# Altium project keckologger.PrjPcb
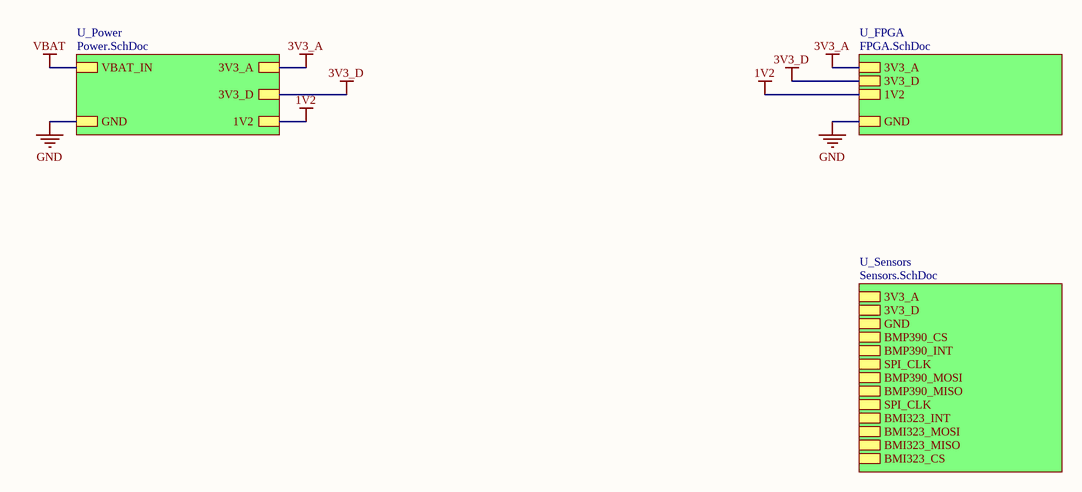
[diagram p0: Main.SchDoc]
7 sheets, 42 parts. Net scope: strictly hierarchical (ports join the sheet entries above them; power ports are local).
Sheets:
  Main.SchDoc
    U_FPGA = FPGA.SchDoc
    U_Power = Power.SchDoc
    U_Sensors = Sensors.SchDoc
  GPS.SchDoc
  Transmitter.SchDoc
  SD Card Reader.SchDoc

## Sheet Main.SchDoc
size A; SheetNumber: 1; SheetTotal: 6

### Sub-sheets
U_FPGA = FPGA.SchDoc: 3V3_A, 3V3_D, 1V2, GND
U_Power = Power.SchDoc: VBAT_IN, GND, 3V3_A, 3V3_D, 1V2
U_Sensors = Sensors.SchDoc: 3V3_A, 3V3_D, GND, BMP390_CS, BMP390_INT, SPI_CLK, BMP390_MOSI, BMP390_MISO, SPI_CLK, BMI323_INT, BMI323_MOSI, BMI323_MISO, BMI323_CS

### Nets
1V2: sheet U_FPGA/1V2, sheet U_Power/1V2
3V3_A: sheet U_FPGA/3V3_A, sheet U_Power/3V3_A
3V3_D: sheet U_FPGA/3V3_D, sheet U_Power/3V3_D
GND: sheet U_FPGA/GND, sheet U_Power/GND
SPI_CLK: sheet U_Sensors/SPI_CLK, sheet U_Sensors/SPI_CLK

## Sheet FPGA.SchDoc
size A; SheetNumber: 3; SheetTotal: 4
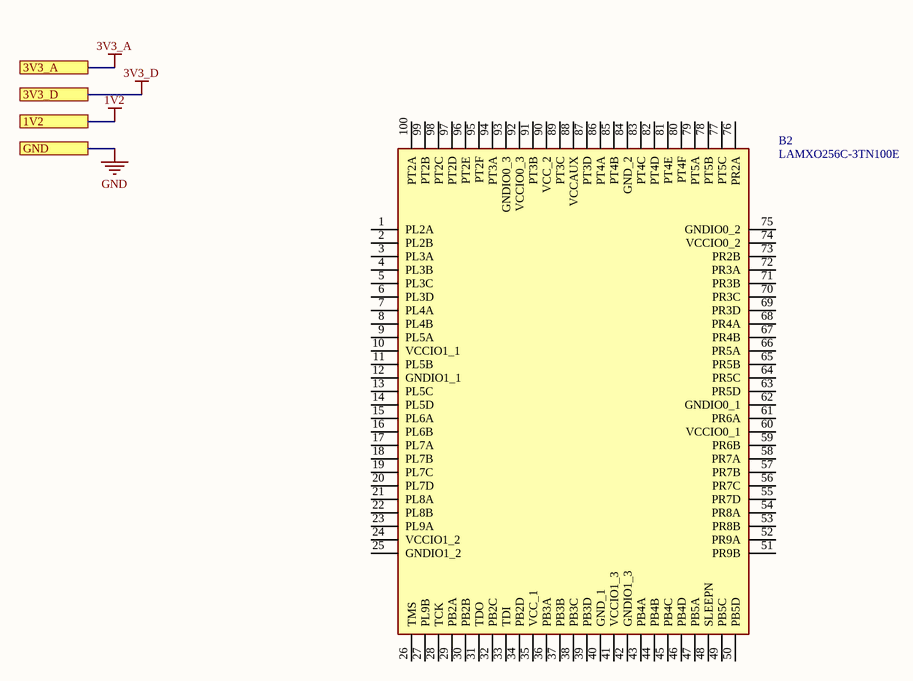
[diagram p1: FPGA.SchDoc]

### Parts
B2  LAMXO256C-3TN100E  [QFP50P1600X1600X160-100N]

### Ports
1V2, 3V3_A, 3V3_D, GND

### Nets

Not connected (* = marked no-connect by the designer): B2 1(PL2A) 2(PL2B) 3(PL3A) 4(PL3B) 5(PL3C) 6(PL3D) 7(PL4A) 8(PL4B) 9(PL5A) 10(VCCIO1_1) 11(PL5B) 12(GNDIO1_1) 13(PL5C) 14(PL5D) 15(PL6A) 16(PL6B) 17(PL7A) 18(PL7B) 19(PL7C) 20(PL7D) 21(PL8A) 22(PL8B) 23(PL9A) 24(VCCIO1_2) 25(GNDIO1_2) 26(TMS) 27(PL9B) 28(TCK) 29(PB2A) 30(PB2B) 31(TDO) 32(PB2C) 33(TDI) 34(PB2D) 35(VCC_1) 36(PB3A) 37(PB3B) 38(PB3C) 39(PB3D) 40(GND_1) 41(VCCIO1_3) 42(GNDIO1_3) 43(PB4A) 44(PB4B) 45(PB4C) 46(PB4D) 47(PB5A) 48(SLEEPN) 49(PB5C) 50(PB5D) 51(PR9B) 52(PR9A) 53(PR8B) 54(PR8A) 55(PR7D) 56(PR7C) 57(PR7B) 58(PR7A) 59(PR6B) 60(VCCIO0_1) 61(PR6A) 62(GNDIO0_1) 63(PR5D) 64(PR5C) 65(PR5B) 66(PR5A) 67(PR4B) 68(PR4A) 69(PR3D) 70(PR3C) 71(PR3B) 72(PR3A) 73(PR2B) 74(VCCIO0_2) 75(GNDIO0_2) 76(PR2A) 77(PT5C) 78(PT5B) 79(PT5A) 80(PT4F) 81(PT4E) 82(PT4D) 83(PT4C) 84(GND_2) 85(PT4B) 86(PT4A) 87(PT3D) 88(VCCAUX) 89(PT3C) 90(VCC_2) 91(PT3B) 92(VCCIO0_3) 93(GNDIO0_3) 94(PT3A) 95(PT2F) 96(PT2E) 97(PT2D) 98(PT2C) 99(PT2B) 100(PT2A)

### Library data of the parts
B2 = LAMXO256C-3TN100E: FPGA - Field Programmable Gate Array Auto Grade (AEC-Q100 ) MachXO256C; Manufacturer_Name: Lattice Semiconductor; Geometry.Height: 1.6mm; Mouser Part Number: 842-LAMXO256C3TN100E; Mouser Price/Stock: https://www.mouser.co.uk/ProductDetail/Lattice/LAMXO256C-3TN100E?qs=p%2Fkho2dxmzgvijKb3pAMgw%3D%3D; Manufacturer_Part_Number: LAMXO256C-3TN100E; Datasheet Link: https://www.latticesemi.com/~/media/LatticeSemi/Documents/Solutions/Packaging%20Solutions/LA_MachXO%20Automotive%20Family%20Data%20Sheet.pdf

## Sheet Power.SchDoc
size A; SheetNumber: 2; SheetTotal: 6
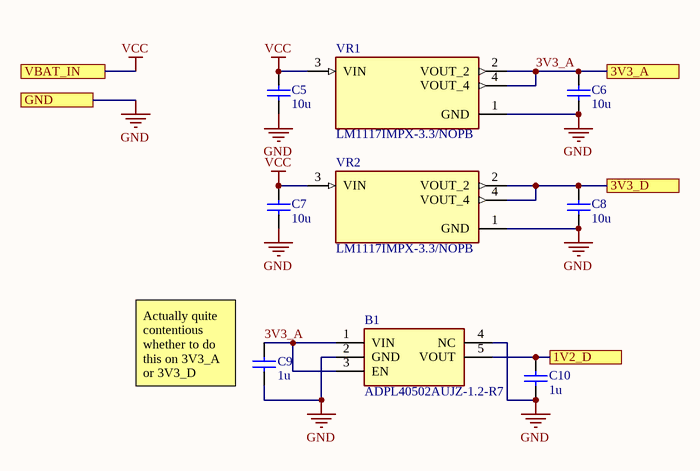
[diagram p2: Power.SchDoc]

### Parts
B1  ADPL40502AUJZ-1.2-R7  [SOT95P280X100-5N]
C5  value 10u  (hidden comment: Capacitor)
C6  value 10u  (hidden comment: Capacitor)
C7  value 10u  (hidden comment: Capacitor)
C8  value 10u  (hidden comment: Capacitor)
C9  value 1u  (hidden comment: Capacitor)
C10  value 1u  (hidden comment: Capacitor)
VR1  LM1117IMPX-3.3/NOPB  [VREG_LM1117IMPX-3.3/NOPB]
VR2  LM1117IMPX-3.3/NOPB  [VREG_LM1117IMPX-3.3/NOPB]

### Ports
1V2_D, 3V3_A, 3V3_D, GND, VBAT_IN

### Nets
3V3_A: B1.1(VIN) B1.3(EN) C6.2 C9.2 VR1.2(VOUT_2) VR1.4(VOUT_4) ; port 3V3_A
3V3_D: C8.2 VR2.2(VOUT_2) VR2.4(VOUT_4) ; port 3V3_D
GND: B1.2(GND) B1.4(NC) C5.1 C6.1 C7.1 C8.1 C9.1 C10.1 VR1.1(GND) VR2.1(GND) ; port GND
VCC: C5.2 C7.2 VR1.3(VIN) VR2.3(VIN) ; port VBAT_IN  [project net VBAT]
NetB1_5: B1.5(VOUT) C10.2 ; port 1V2_D

### Notes on the sheet
- (near C9) Actually quite contentious whether to do this on 3V3_A or 3V3_D

### Library data of the parts
B1 = ADPL40502AUJZ-1.2-R7: Low Noise, 200mA, CMOS Linear Regulator; Manufacturer_Name: Analog Devices; Geometry.Height: 1mm; Mouser Part Number: *; Mouser Price/Stock: *; Manufacturer_Part_Number: ADPL40502AUJZ-1.2-R7; Datasheet Link: https://www.analog.com/ADPL40502/datasheet
C5-C10 = Capacitor: SimulationGenericComponent: True
VR1 VR2 = LM1117IMPX-3.3/NOPB: 800-mA 15-V linear voltage regulator; MF: Texas Instruments; SnapEDA_Link: https://www.snapeda.com/parts/LM1117IMPX-3.3/NOPB/Texas+Instruments/view-part/?ref=snap; Package: SOT-223-4 Texas Instruments; Value: *; MP: LM1117IMPX-3.3/NOPB; Check_prices: https://www.snapeda.com/parts/LM1117IMPX-3.3/NOPB/Texas+Instruments/view-part/?ref=eda

## Sheet Sensors.SchDoc
size A; SheetNumber: 4; SheetTotal: 6
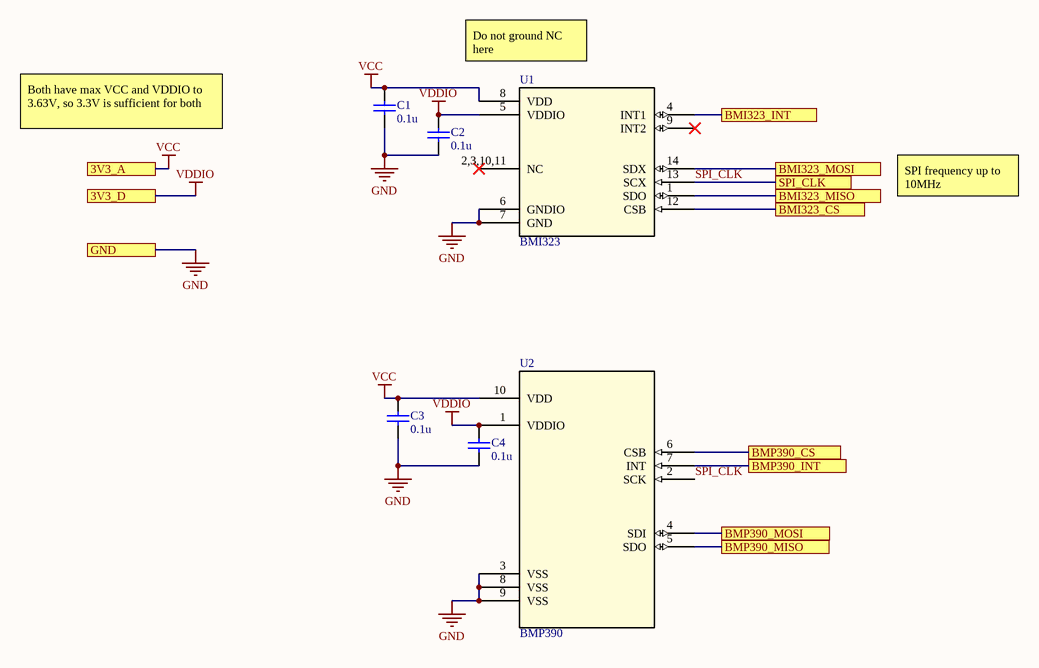
[diagram p3: Sensors.SchDoc]

### Parts
C1  value 0.1u  (hidden comment: Capacitor)
C2  value 0.1u  (hidden comment: Capacitor)
C3  value 0.1u  (hidden comment: Capacitor)
C4  value 0.1u  (hidden comment: Capacitor)
U1  BMI323  [BMI323_BOS]
U2  BMP390  [10LGA_2X2X0p75_BOS]

### Ports
3V3_A, 3V3_D, BMI323_CS, BMI323_INT, BMI323_MISO, BMI323_MOSI, BMP390_CS, BMP390_INT, BMP390_MISO, BMP390_MOSI, GND, SPI_CLK

### Nets
GND: C1.1 C2.1 C3.1 C4.1 U1.6(GNDIO) U1.7(GND) U2.3(VSS) U2.8(VSS) U2.9(VSS) ; port GND
VCC: C1.2 C3.2 U1.8(VDD) U2.10(VDD) ; port 3V3_A
VDDIO: C2.2 C4.2 U1.5(VDDIO) U2.1(VDDIO) ; port 3V3_D
SPI_CLK: U1.13(SCX) U2.2(SCK) ; port SPI_CLK
NetU1_1: U1.1(SDO) ; port BMI323_MISO
NetU1_4: U1.4(INT1) ; port BMI323_INT
NetU1_12: U1.12(CSB) ; port BMI323_CS
NetU1_14: U1.14(SDX) ; port BMI323_MOSI
NetU2_4: U2.4(SDI) ; port BMP390_MOSI
NetU2_5: U2.5(SDO) ; port BMP390_MISO
NetU2_6: U2.6(CSB) ; port BMP390_CS
NetU2_7: U2.7(INT) ; port BMP390_INT

Not connected (* = marked no-connect by the designer): U1 2,3,10,11(NC)* 9(INT2)*

### Notes on the sheet
- (near U1) Do not ground NC here
- Both have max VCC and VDDIO to 3.63V, so 3.3V is sufficient for both
- SPI frequency up to 10MHz

### Library data of the parts
C1-C4 = Capacitor: SimulationGenericComponent: True
U1 = BMI323: Description; Manufacturer_Name: Bosch Sensortec; Copyright: Copyright (C) 2025 Ultra Librarian. All rights reserved.; Manufacturer_Part_Number: BMI323; RefDes: RefDes; Type: Type
U2 = BMP390: Description; Manufacturer_Name: Bosch Sensortec; Copyright: Copyright (C) 2025 Ultra Librarian. All rights reserved.; Manufacturer_Part_Number: BMP390; RefDes: RefDes; Type: Type

## Sheet GPS.SchDoc
size A; SheetNumber: 5; SheetTotal: 6
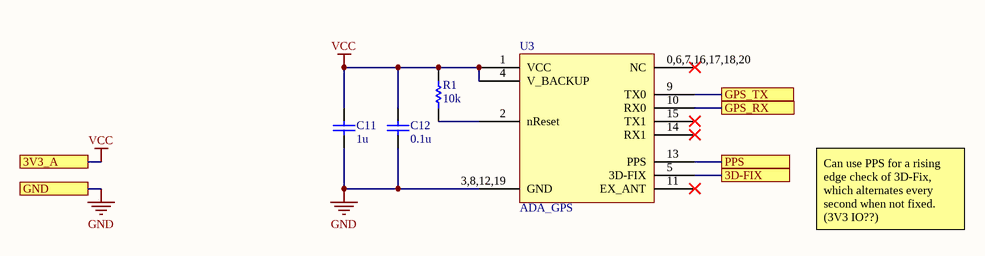
[diagram p4: GPS.SchDoc]

### Parts
C11  value 1u  (hidden comment: Capacitor)
C12  value 0.1u  (hidden comment: Capacitor)
R1  value 10k  (hidden comment: Resistor)
U3  ADA_GPS  [PA1616D]

### Ports
3D-FIX, 3V3_A, GND, GPS_RX, GPS_TX, PPS

### Nets
GND: C11.1 C12.1 U3.3,8,12,19(GND) ; port GND
VCC: C11.2 C12.2 R1.2 U3.1(VCC) U3.4(V_BACKUP) ; port 3V3_A
NetR1_1: R1.1 U3.2(nReset)
NetU3_5: U3.5(3D-FIX) ; port 3D-FIX
NetU3_9: U3.9(TX0) ; port GPS_TX
NetU3_10: U3.10(RX0) ; port GPS_RX
NetU3_13: U3.13(PPS) ; port PPS

Not connected (* = marked no-connect by the designer): U3 0,6,7,16,17,18,20(NC)* 11(EX_ANT)* 14(RX1)* 15(TX1)*

### Notes on the sheet
- Can use PPS for a rising edge check of 3D-Fix, which alternates every second when not fixed. (3V3 IO??)

### Library data of the parts
C11 C12 = Capacitor: SimulationGenericComponent: True
R1 = Resistor: TC1: 0; SimulationGenericComponent: True; TC2: 0

## Sheet Transmitter.SchDoc
size A; SheetNumber: 6; SheetTotal: 6
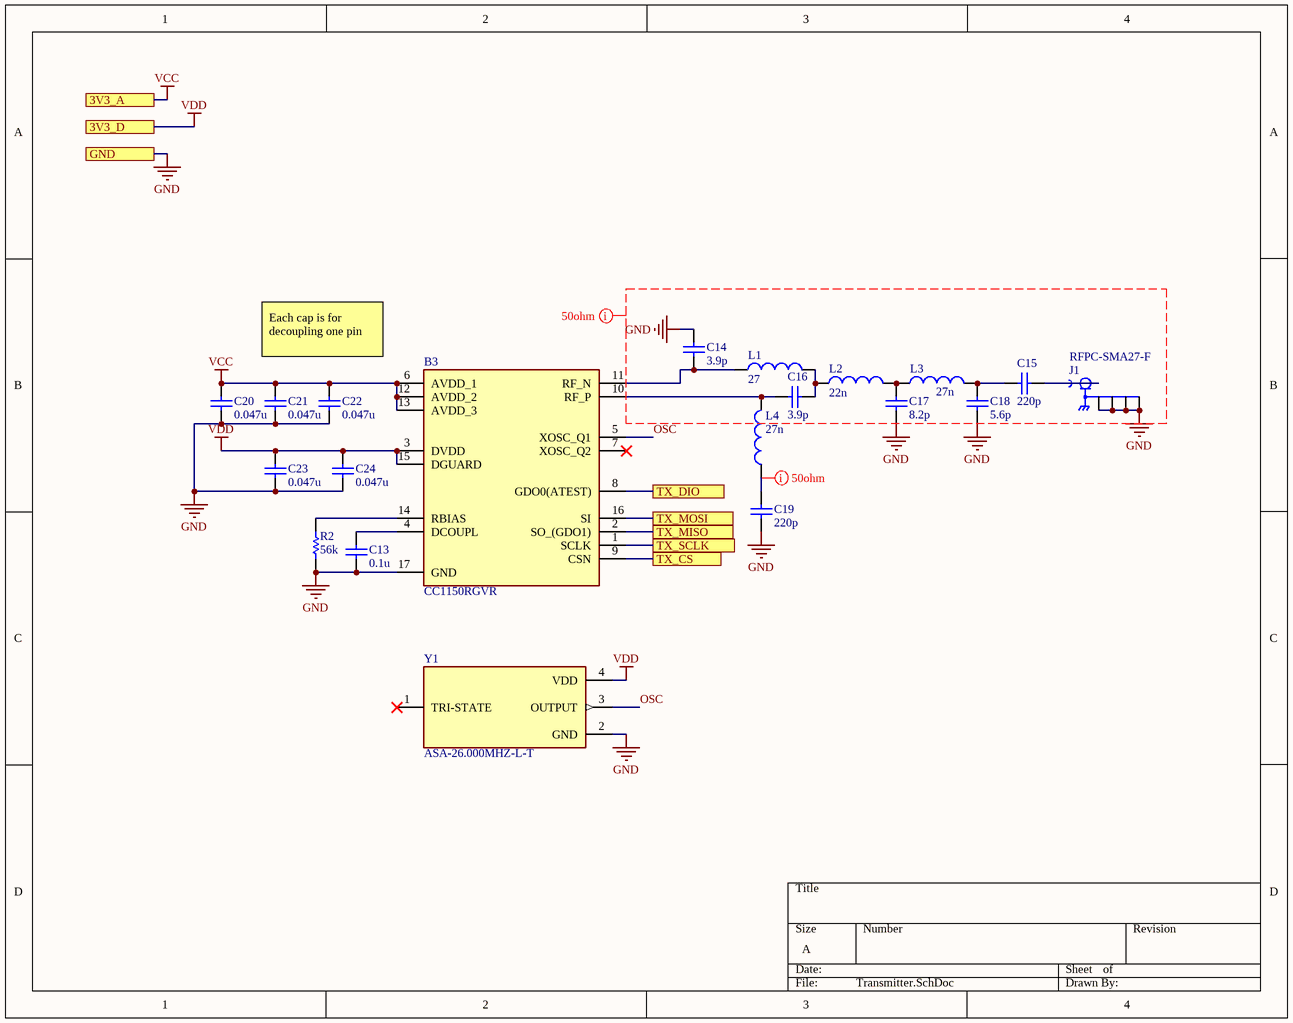
[diagram p5: Transmitter.SchDoc]

### Parts
B3  CC1150RGVR  [QFN65P400X400X100-17N-D]
C13  value 0.1u  (hidden comment: Capacitor)
C14  value 3.9p  (hidden comment: Capacitor)
C15  value 220p  (hidden comment: Capacitor)
C16  value 3.9p  (hidden comment: Capacitor)
C17  value 8.2p  (hidden comment: Capacitor)
C18  value 5.6p  (hidden comment: Capacitor)
C19  value 220p  (hidden comment: Capacitor)
C20  value 0.047u  (hidden comment: Capacitor)
C21  value 0.047u  (hidden comment: Capacitor)
C22  value 0.047u  (hidden comment: Capacitor)
C23  value 0.047u  (hidden comment: Capacitor)
C24  value 0.047u  (hidden comment: Capacitor)
J1  RFPC-SMA27-F  [GRADCONN_RFPC-SMA27-F]
L1  value 27  (hidden comment: Inductor)
L2  value 22n  (hidden comment: Inductor)
L3  value 27n  (hidden comment: Inductor)
L4  value 27n  (hidden comment: Inductor)
R2  value 56k  (hidden comment: Resistor)
Y1  ASA-26.000MHZ-L-T  [XTAL_ASA-26.000MHZ-L-T]

### Ports
3V3_A, 3V3_D, GND, TX_CS, TX_DIO, TX_MISO, TX_MOSI, TX_SCLK

### Nets
GND: B3.17(GND) C13.1 C14.2 C17.1 C18.1 C19.1 C20.1 C21.1 C22.1 C23.1 C24.1 J1.G1 J1.G2 J1.G3 J1.G4 R2.1 Y1.2(GND) ; port GND
VCC: B3.6(AVDD_1) B3.12(AVDD_2) B3.13(AVDD_3) C20.2 C21.2 C22.2 ; port 3V3_A
VDD: B3.3(DVDD) B3.15(DGUARD) C23.2 C24.2 Y1.4(VDD) ; port 3V3_D
OSC: B3.5(XOSC_Q1) Y1.3(OUTPUT)
NetB3_1: B3.1(SCLK) ; port TX_SCLK
NetB3_2: B3.2(SO_(GDO1)) ; port TX_MISO
NetB3_4: B3.4(DCOUPL) C13.2
NetB3_8: B3.8(GDO0(ATEST)) ; port TX_DIO
NetB3_9: B3.9(CSN) ; port TX_CS
NetB3_10: B3.10(RF_P) C16.2 L4.2
NetB3_11: B3.11(RF_N) C14.1 L1.1
NetB3_14: B3.14(RBIAS) R2.2
NetB3_16: B3.16(SI) ; port TX_MOSI
NetC15_1: C15.1 J1.1
NetC15_2: C15.2 C18.2 L3.2
NetC16_1: C16.1 L1.2 L2.1
NetC17_2: C17.2 L2.2 L3.1
NetC19_2: C19.2 L4.1

Not connected (* = marked no-connect by the designer): B3 7(XOSC_Q2)*; Y1 1(TRI-STATE)*

### Layout directives
mark named 50ohm: GND, NetC19_2

### Notes on the sheet
- Each cap is for decoupling one pin

### Library data of the parts
B3 = CC1150RGVR: Highly Integrated Multichannel RF Transmitter Designed for Low-Power Wireless Applications; Manufacturer_Name: Texas Instruments; Geometry.Height: 1mm; Mouser Part Number: 595-CC1150RGVR; Mouser Price/Stock: https://www.mouser.com/Search/Refine.aspx?Keyword=595-CC1150RGVR; Manufacturer_Part_Number: CC1150RGVR; Datasheet Link: http://www.ti.com/lit/gpn/CC1150
C13-C24 = Capacitor: SimulationGenericComponent: True
J1 = CMP-012-000000-1: MF: {'manufacturer': u'GCT (Gradconn)'}; MP: RFPC-SMA27-F; Value: *; Pin Count: 5; Source: RFPC-SMA27-F.SchLib; Package: None; Price: None; Design Item ID: RFPC-SMA27-F; Component Type: Standard; Availability: Unavailable
L1-L4 = Inductor: SimulationGenericComponent: True
R2 = Resistor: TC1: 0; SimulationGenericComponent: True; TC2: 0
Y1 = CMP-010-000000-1: Design Item ID: ASA-26.000MHZ-L-T; Price: None; Package: None; Component Type: Standard; Source: ASA-26.000MHZ-L-T.SchLib; Value: *; Availability: Unavailable; Pin Count: 4; MP: ASA-26.000MHZ-L-T

## Sheet SD Card Reader.SchDoc
size A; SheetNumber: 7; SheetTotal: 7
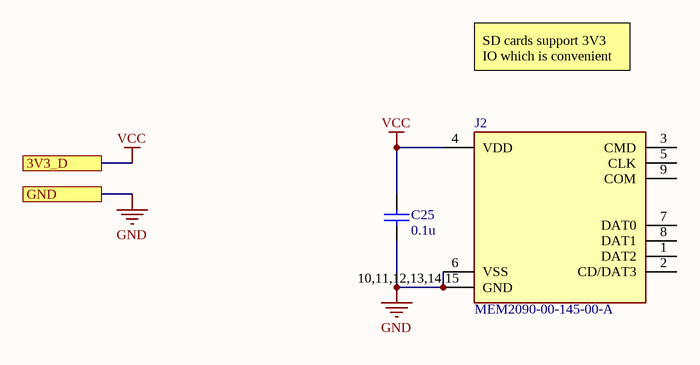
[diagram p6: SD Card Reader.SchDoc]

### Parts
C25  value 0.1u  (hidden comment: Capacitor)
J2  MEM2090-00-145-00-A  [MEM20900014500A]

### Ports
3V3_D, GND

### Nets
GND: C25.1 J2.6(VSS) J2.10,11,12,13,14,15(GND) ; port GND
VCC: C25.2 J2.4(VDD) ; port 3V3_D

Not connected (* = marked no-connect by the designer): J2 1(DAT2) 2(CD/DAT3) 3(CMD) 5(CLK) 7(DAT0) 8(DAT1) 9(COM)

### Notes on the sheet
- SD cards support 3V3 IO which is convenient

### Library data of the parts
C25 = Capacitor: SimulationGenericComponent: True
J2 = MEM2090-00-145-00-A: Memory Card Connectors Micro SD Push-Push, Normaly Open, SMT, 1.45mm Profile, No Peg; Manufacturer_Name: GCT (GLOBAL CONNECTOR TECHNOLOGY); Geometry.Height: 1.6mm; Mouser Part Number: 640-MEM20900014500A; Mouser Price/Stock: https://www.mouser.co.uk/ProductDetail/GCT/MEM2090-00-145-00-A?qs=jRuttqqUwMR0RI4XLNZI4Q%3D%3D; Manufacturer_Part_Number: MEM2090-00-145-00-A; Datasheet Link: https://www.mouser.at/datasheet/2/837/mem2090-3435332.pdf